# EAGLE design BB Turret (EAGLE 9.6.2)
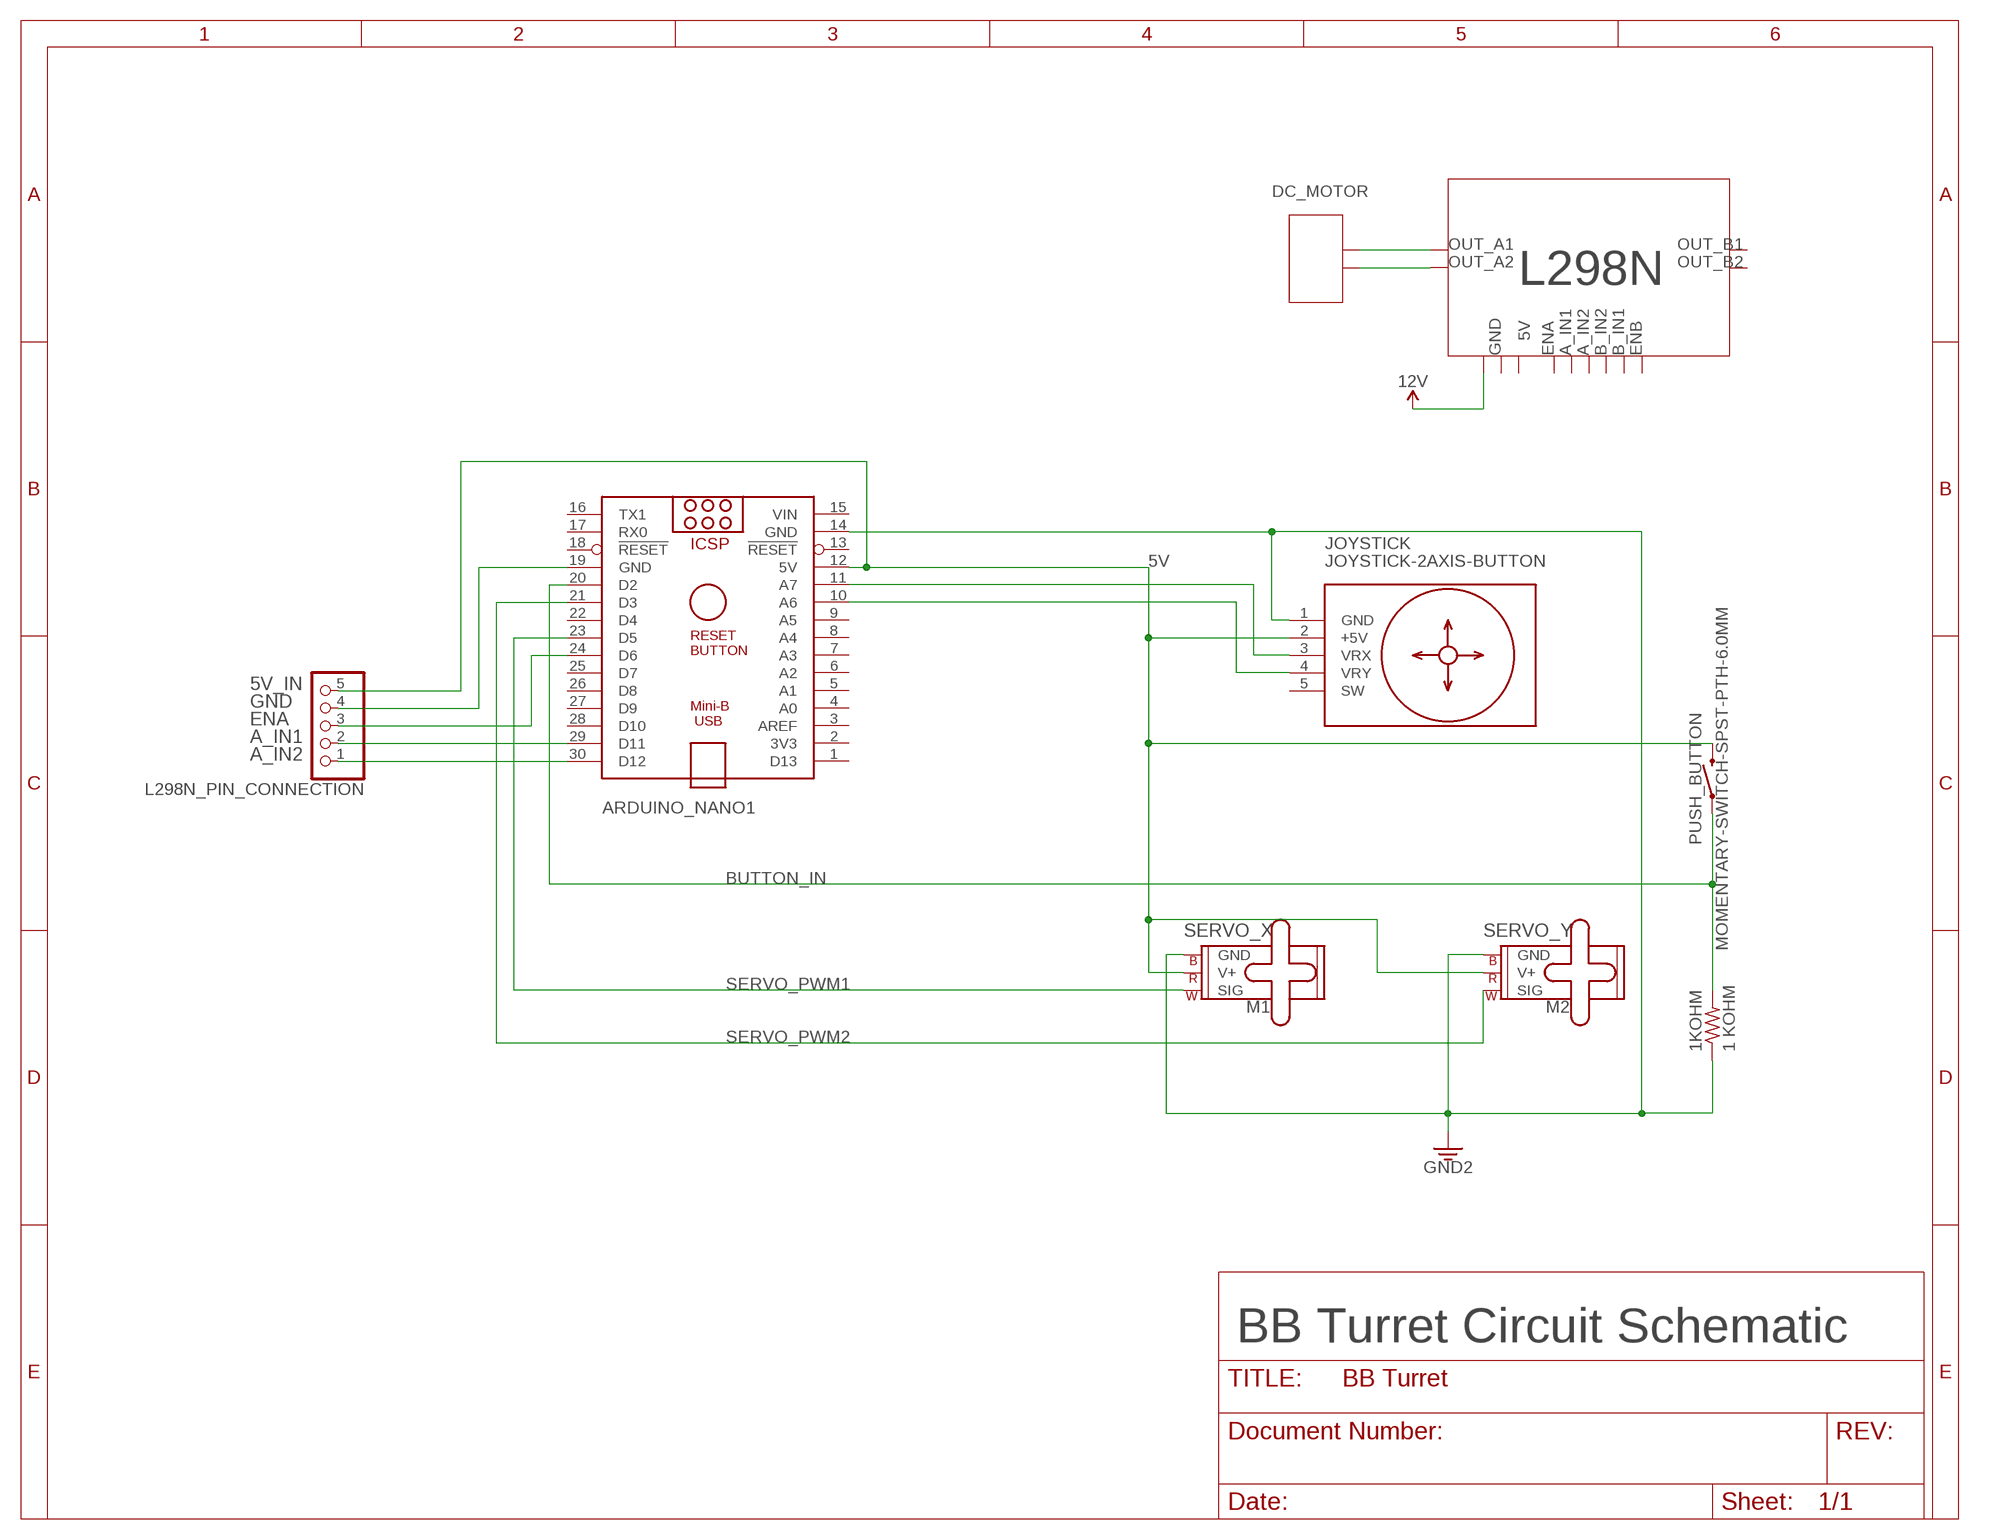
[diagram p0: schematic, sheet 1]

## Parts
1KOHM  1 KOHM  R-US_0204/7  [0204/7]
ARDUINO_NANO1  ARDUINO_NANO  [ARDUINO_NANO]
JOYSTICK  JOYSTICK-2AXIS-BUTTON  [JOYSTICK-2AXIS-BUTTON]
L298N_PIN_CONNECTION  PINHD-1X5  [1X05]
M1  SERVO  [1X03]
M2  SERVO  [1X03]
PUSH_BUTTON  MOMENTARY-SWITCH-SPST-PTH-6.0MM  [TACTILE_SWITCH_PTH_6.0MM]

## Nets
5V: ARDUINO_NANO1.12(5V) JOYSTICK.2(+5V) L298N_PIN_CONNECTION.5 M1.2(V+) M2.2(V+) PUSH_BUTTON.3
A_IN1: ARDUINO_NANO1.29(D11) L298N_PIN_CONNECTION.2
A_IN2: ARDUINO_NANO1.30(D12) L298N_PIN_CONNECTION.1
BUTTON_IN: 1KOHM.2 ARDUINO_NANO1.20(D2) PUSH_BUTTON.1
ENA: ARDUINO_NANO1.24(D6) L298N_PIN_CONNECTION.3
GND: 1KOHM.1 ARDUINO_NANO1.14(GND) ARDUINO_NANO1.19(GND) JOYSTICK.1(GND) L298N_PIN_CONNECTION.4 M1.3(GND) M2.3(GND) ; supply symbol labelled GND2
SERVO_PWM1: ARDUINO_NANO1.23(D5) M1.1(SIG)
SERVO_PWM2: ARDUINO_NANO1.21(D3) M2.1(SIG)
VRX: ARDUINO_NANO1.11(A7) JOYSTICK.3(VRX)
VRY: ARDUINO_NANO1.10(A6) JOYSTICK.4(VRY)
Unconnected: ARDUINO_NANO1.1(D13) ARDUINO_NANO1.2(3V3) ARDUINO_NANO1.3(AREF) ARDUINO_NANO1.4(A0) ARDUINO_NANO1.5(A1) ARDUINO_NANO1.6(A2) ARDUINO_NANO1.7(A3) ARDUINO_NANO1.8(A4) ARDUINO_NANO1.9(A5) ARDUINO_NANO1.13(!RESET) ARDUINO_NANO1.16(TX1) ARDUINO_NANO1.17(RX0) ARDUINO_NANO1.18(!RESET) ARDUINO_NANO1.22(D4) ARDUINO_NANO1.25(D7) ARDUINO_NANO1.26(D8) ARDUINO_NANO1.27(D9) ARDUINO_NANO1.28(D10) JOYSTICK.5(SW)

## Notes on the sheet
- DC_MOTOR
- OUT_A1 | OUT_B1
- OUT_A2 | OUT_B2
- L298N
- 5V
- GND | ENA | A_IN1 | A_IN2 | B_IN2 | B_IN1 | ENB
- 5V_IN
- GND
- ENA
- A_IN1
- A_IN2
- SERVO_X | SERVO_Y
- BB Turret Circuit Schematic

## Power pins joined to a net without a drawn wire
VIN: ARDUINO_NANO1.15(VIN)

## Library data of the parts
1KOHM = rcl:R-US_: RESISTOR, American symbol; SPICEPREFIX: R
ARDUINO_NANO1 = ArduinoNanoV30:ARDUINO_NANO: Arduino Nano V3.0 Overview: The Arduino Nano is a small, complete, and breadboard-friendly board based on the ATmega328 (Arduino Nano 3.x) or ATmega168 (Arduino Nano 2.x). It has more or less the same functionality of the Arduino Duemilanove, but in a different package. It lacks only a DC power jack, and works with a Mini-B USB cable instead of a standard one. The Nano was designed and is being produced by Gravitech. Specifications: Microcontroller Atmel ATmega168 or ATmega328 Operating Voltage (logic level) 5 V Input Voltage (recommended) 7-12 V Input Voltage (limits) 6-20 V Digital I/O Pins 14 (of which 6 provide PWM output) Analog Input Pins 8 DC Current per I/O Pin 40 mA Flash Memory 16 KB (ATmega168) or 32 KB (ATmega328) of which 2 KB used by bootloader SRAM 1 KB (ATmega168) or 2 KB (ATmega328) EEPROM 512 bytes (ATmega168) or 1 KB (ATmega328) Clock Speed 16 MHz Dimensions 0.73" x 1.70" Length 45 mm Width 18 mm Weigth 5 g Power: The Arduino Nano can be powered via the Mini-B USB connection, 6-20V unregulated external power supply (pin 30), or 5V regulated external power supply (pin 27). The power source is automatically selected to the highest voltage source. Memory: The ATmega168 has 16 KB of flash memory for storing code (of which 2 KB is used for the bootloader); the ATmega328 has 32 KB, (also with 2 KB used for the bootloader). The ATmega168 has 1 KB of SRAM and 512 bytes of EEPROM (which can be read and written with the EEPROM library); the ATmega328 has 2 KB of SRAM and 1 KB of EEPROM. Input and Output: Each of the 14 digital pins on the Nano can be used as an input or output, using pinMode(), digitalWrite(), and digitalRead() functions. They operate at 5 volts. Each pin can provide or receive a maximum of 40 mA and has an internal pull-up resistor (disconnected by default) of 20-50 kOhms. In addition, some pins have specialized functions. Visit Arduino - ArduinoBoardNano <https://www.arduino.cc/en/Main/ArduinoBoardNano>
JOYSTICK = diy-modules:JOYSTICK-2AXIS-BUTTON: 2-Axis Analog Joystick with Push Button Tutorial is available here: http://henrysbench.capnfatz.com/henrys-bench/arduino-sensors-and-input/arduino-ps2-joystick-tutorial-keyes-ky-023-deek-robot/ Click here to find device on ebay.com <http://www.ebay.com/sch/joystick+ps2+module>
L298N_PIN_CONNECTION = pinhead:PINHD-1X5: PIN HEADER
M1 M2 = SparkFun-Electromechanical:SERVO: Servo Motor 3-pin connector for a standard servo motor (voltage supply, ground, and control signal.) SparkFun Products Servo - Generic (Sub-Micro Size) <https://www.sparkfun.com/products/9065> (ROB-09065) Servo - Generic High Torque Continuous Rotation (Standard Size) <https://www.sparkfun.com/products/9347> (ROB-09347) Servo - Generic High Torque (Standard Size) <https://www.sparkfun.com/products/11965> (ROB-11965)
PUSH_BUTTON = SparkFun-Switches:MOMENTARY-SWITCH-SPST: Momentary Switch (Pushbutton) - SPST Normally-open (NO) SPST momentary switches (buttons, pushbuttons). Variants PTH-12MM - 12mm square, through-hole Momentary Pushbutton Switch - 12mm Square <https://www.sparkfun.com/products/9190> (COM-09190) PTH-6.0MM, PTH-6.0MM-KIT - 6.0mm square, through-hole Mini Pushbutton Switch <https://www.sparkfun.com/products/97> (COM-00097) KIT package intended for soldering kit's - only one side of pads' copper is exposed. PTH-RIGHT-ANGLE-KIT - Right-angle, through-hole Right Angle Tactile Button <https://www.sparkfun.com/products/10791> - Used on SparkFun BigTime Watch Kit <https://www.sparkfun.com/products/11734> SMD-12MM - 12mm square, surface-mount Tactile Button - SMD (12mm) <https://www.sparkfun.com/products/12993> (COM-12993) Used on SparkFun PicoBoard <https://www.sparkfun.com/products/11888> SMD-4.5MM - 4.5mm Square Trackball Switch Used on SparkFun Blackberry Trackballer Breakout <https://www.sparkfun.com/products/13169> SMD-4.6MMX2.8MM - 4.60mm x 2.80mm, surface mount Used on SparkFun Pro Micro - RP2040 <https://www.sparkfun.com/products/17717> SMD-5.2MM, SMD-5.2-REDUNDANT - 5.2mm square, surface-mount Mini Pushbutton Switch - SMD <https://www.sparkfun.com/products/8720> (COM-08720) Used on Arduino Pro Mini <https://www.sparkfun.com/products/11114> REDUNDANT package connects both switch circuits together SMD-6.0X3.5MM - 6.0 x 3.5mm, surface mount Momentary Reset Switch SMD <https://www.sparkfun.com/products/8229> (COM-08229) SMD-6.2MM-TALL - 6.2mm square, surface mount Tactile Button - SMD (6mm) <https://www.sparkfun.com/products/12992> Used on SparkFun Digital Sandbox <https://www.sparkfun.com/products/12651> SMD-RIGHT-ANGLE - Right-angle, surface mount Used on SparkFun Block for Intel® Edison - Arduino <https://www.sparkfun.com/products/13036>; PROD_ID: SWCH-08441; SF_SKU: COM-00097

## Board
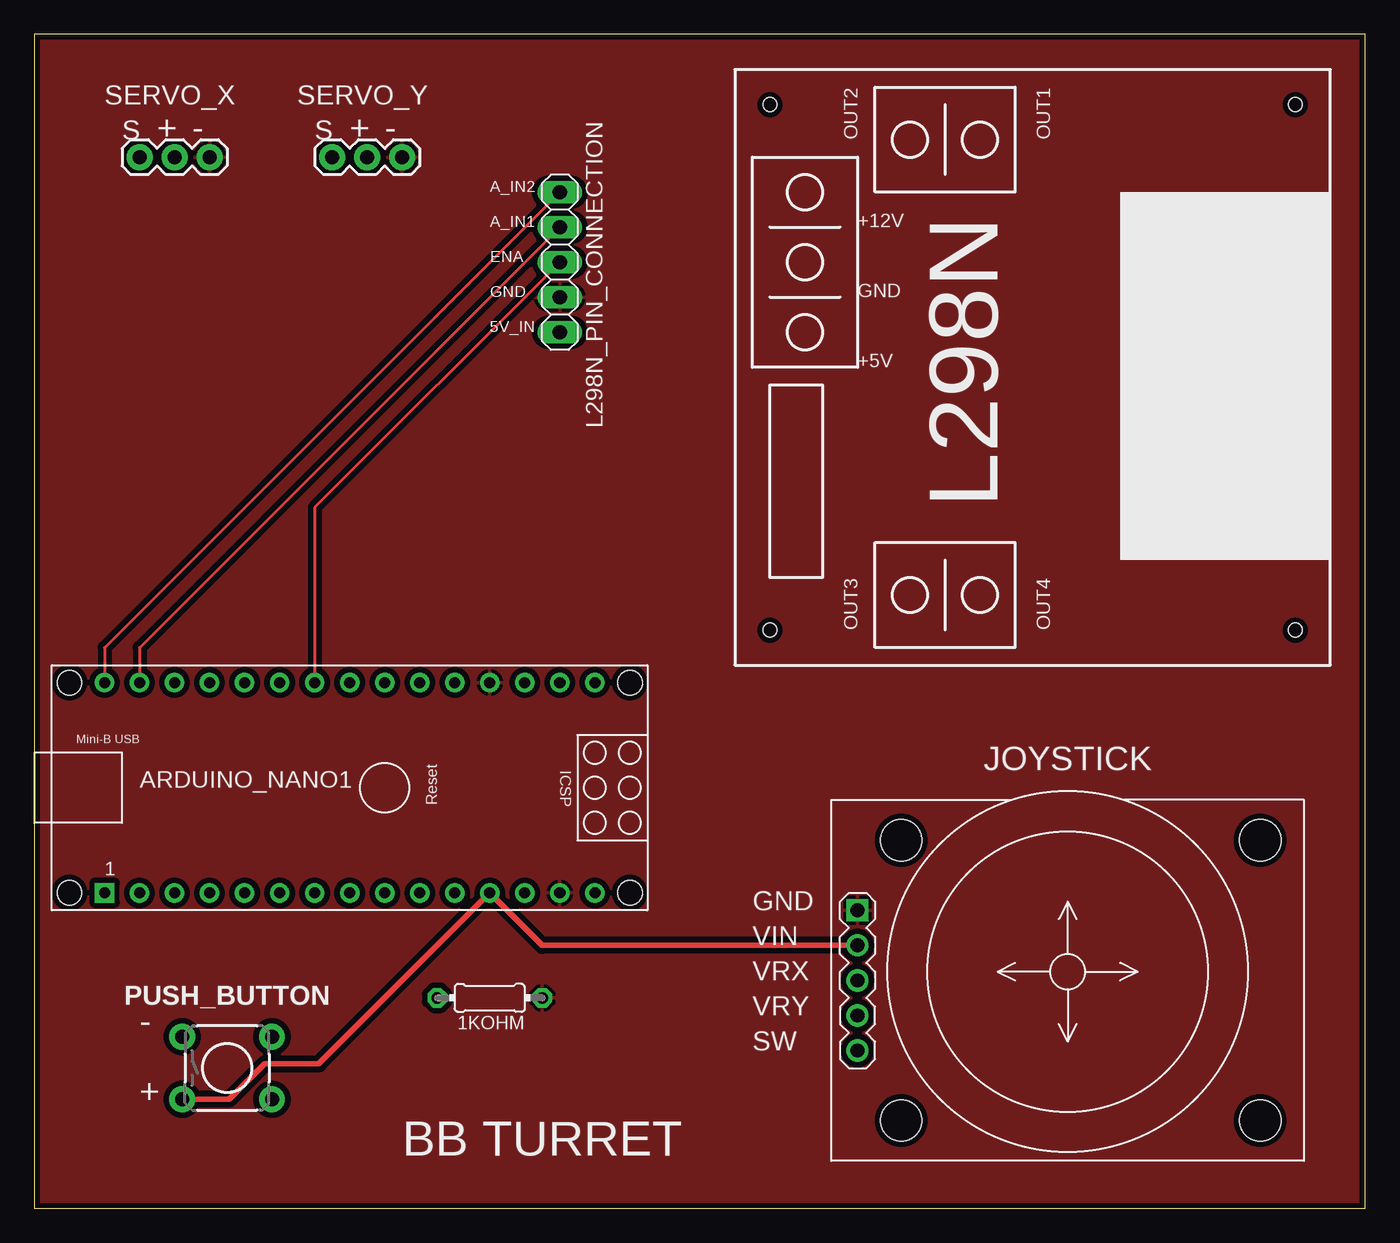
[diagram p1: board, top side]
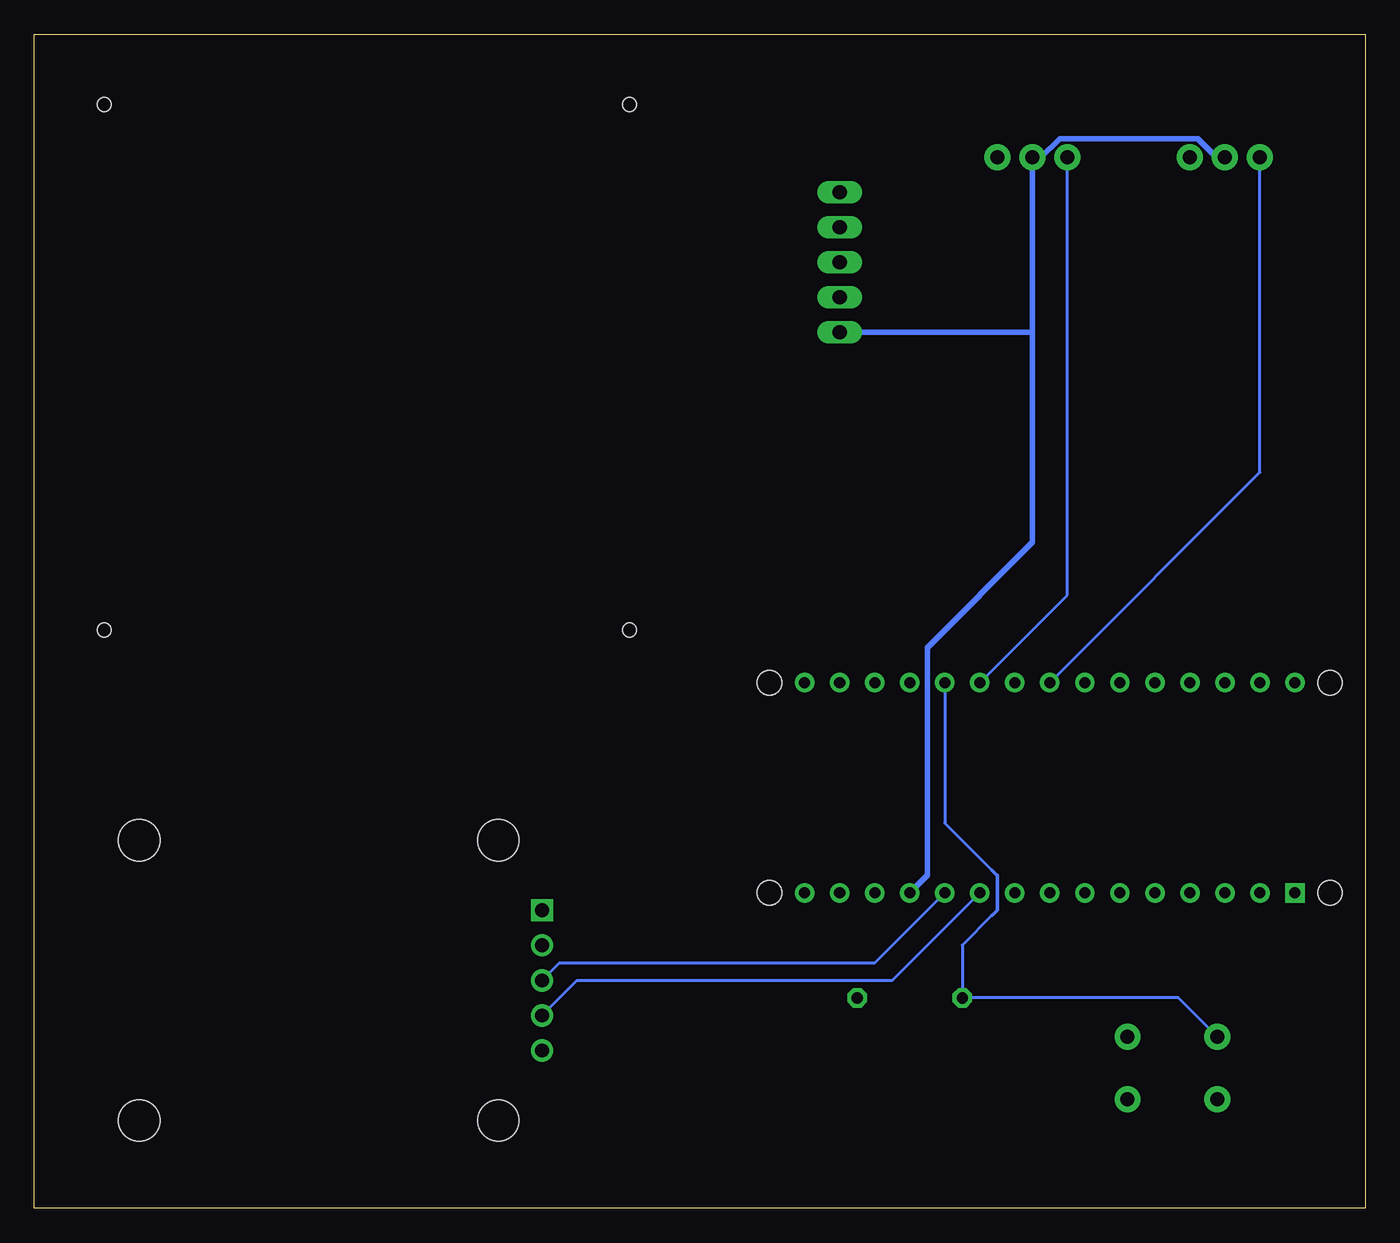
[diagram p2: board, bottom side, seen from below]

Size 96.5 x 85.09 mm. Coordinates in mm from the lower left corner, seen from the top.
Outline: 0,0 96.5,0 96.5,85.09 0,85.09 0,0
Copper layers (1*16): Top 0.035mm / dielectric 1.5mm / Bottom 0.035mm
Design rules "SparkFun": minimum track width 8mil, minimum drill 20mil, track to track 8mil, track to pad 8mil, pad to pad 8mil, via to via 8mil, smd to smd 8mil, copper to edge 10mil, drill to drill 8mil, minimum pad ring 12mil, minimum via ring 10mil, stop-mask expansion 4mil, vias tented up to drill 25mil, thermal gap 10mil
Holes 1 mm at 53.34,41.91 91.44,41.91 91.44,80.01 53.34,80.01

### Footprints (pad centres in the part's own frame; a part is rotated, then mirrored left to right if it is on the bottom)
0204/7 = drill 0.813 octagon: 1 -3.81,0; 2 3.81,0
ARDUINO_NANO = drill 0.8 square: 1 -20.32,-7.62 | drill 0.8: 2 -17.78,-7.62; 3 -15.24,-7.62; 4 -12.7,-7.62; 5 -10.16,-7.62; 6 -7.62,-7.62; 7 -5.08,-7.62; 8 -2.54,-7.62; 9 0,-7.62; 10 2.54,-7.62; 11 5.08,-7.62; 12 7.62,-7.62; 13 10.16,-7.62; 14 12.7,-7.62; 15 15.24,-7.62; 16 15.24,7.62; 17 12.7,7.62; 18 10.16,7.62; 19 7.62,7.62; 20 5.08,7.62; 21 2.54,7.62; 22 0,7.62; 23 -2.54,7.62; 24 -5.08,7.62; 25 -7.62,7.62; 26 -10.16,7.62; 27 -12.7,7.62; 28 -15.24,7.62; 29 -17.78,7.62; 30 -20.32,7.62 | hole 1.778: -22.86,-7.62; -22.86,7.62; 17.78,7.62; 17.78,-7.62
JOYSTICK-2AXIS-BUTTON = drill 1 square: 1 -15.24,5.08 | drill 1: 2 -15.24,2.54; 3 -15.24,0; 4 -15.24,-2.54; 5 -15.24,-5.08 | hole 3: -12.065,10.16; -12.065,-10.16; 13.97,-10.16; 13.97,10.16
1X05 = drill 1.016 long: 1 -5.08,0; 2 -2.54,0; 3 0,0; 4 2.54,0; 5 5.08,0
1X03 = drill 1.016 pad 1.88: 1 0,0; 2 2.54,0; 3 5.08,0
TACTILE_SWITCH_PTH_6.0MM = drill 1.016 pad 1.88: 1 -3.251,2.261; 2 3.251,2.261; 3 -3.251,-2.261; 4 3.251,-2.261

### Placement (x,y rotation side)
1KOHM  33.02,15.24 180 top
ARDUINO_NANO1  25.4,30.48 0 top
JOYSTICK  74.93,16.51 0 top
L298N_PIN_CONNECTION  38.1,68.58 270 top
M1  7.62,76.2 0 top
M2  21.59,76.2 0 top
PUSH_BUTTON  13.97,10.16 0 top

### Tracks (layer width: path | path; a pad name or v marks a point on that pad's centre or on a via)
5V
  Top 0.406: PUSH_BUTTON.3 14.12,7.9 16.68,10.46 20.62,10.46 ARDUINO_NANO1.12 36.83,19.05 JOYSTICK.2
  Bottom 0.406: 24.13,63.5 M2.2 23.49,76.2 22.15,77.55 12.14,77.55 10.8,76.2 M1.2 | 24.13,63.5 24.13,48.26 31.75,40.64 31.75,24.13 ARDUINO_NANO1.12 | L298N_PIN_CONNECTION.5 24.13,63.5
A_IN1
  Top 0.203: L298N_PIN_CONNECTION.2 7.62,40.64 ARDUINO_NANO1.29
A_IN2
  Top 0.203: L298N_PIN_CONNECTION.1 5.08,40.64 ARDUINO_NANO1.30
BUTTON_IN
  Bottom 0.203: PUSH_BUTTON.1 13.54,15.24 1KOHM.2 29.21,19.07 27.06,21.22 | ARDUINO_NANO1.20 30.48,27.92 27.06,24.5
  Bottom 0.254: 27.06,24.5 26.69,24.13 26.67,24.13 26.67,21.59 27.04,21.22 27.06,21.22
ENA
  Top 0.203: L298N_PIN_CONNECTION.3 20.32,50.8 ARDUINO_NANO1.24
GND
  pour Top (isolate 0.406): 0,0 0,85.09 96.52,85.09 96.52,0
SERVO_PWM1
  Bottom 0.203: ARDUINO_NANO1.23 7.62,53.34 M1.1
SERVO_PWM2
  Bottom 0.203: ARDUINO_NANO1.21 21.59,44.45 M2.1
VRX
  Bottom 0.203: JOYSTICK.3 58.42,17.78 35.56,17.78 ARDUINO_NANO1.11
VRY
  Bottom 0.203: JOYSTICK.4 57.15,16.51 34.29,16.51 ARDUINO_NANO1.10

### Text on the board
tPlace: SERVO_X | SERVO_Y | S | + | - | S | + | - | OUT2 | OUT1 | A_IN2 | A_IN1 | +12V | ENA | GND | GND | 5V_IN | +5V | OUT3 | OUT4 | GND | VIN | VRX | VRY | - | SW | + | BB TURRET
tNames: L298N